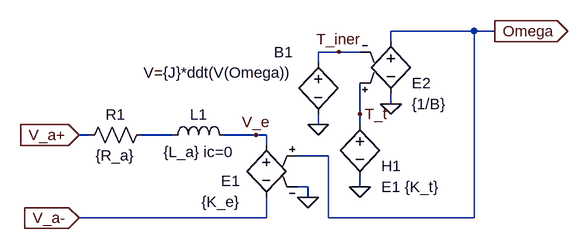
[diagram p0: schematic Standalone_LTspice_PMDC_motor.asc]
Standalone_LTspice_PMDC_motor.asc, the LTspice schematic file:
Version 4.1
SHEET 1 880 680
WIRE 336 32 208 32
WIRE 368 32 336 32
WIRE 208 48 208 32
WIRE 128 64 96 64
WIRE 160 64 128 64
WIRE 96 80 96 64
WIRE 208 144 208 128
WIRE 160 160 160 112
WIRE 96 176 96 160
WIRE 160 176 160 160
WIRE -256 192 -272 192
WIRE -128 192 -176 192
WIRE 0 192 -48 192
WIRE 16 192 0 192
WIRE 16 208 16 192
WIRE 112 224 64 224
WIRE 80 272 64 272
WIRE 160 272 160 256
WIRE 80 288 80 272
WIRE 16 320 16 288
WIRE 16 320 -272 320
WIRE 112 320 112 224
WIRE 336 320 336 32
WIRE 336 320 112 320
FLAG 96 176 0
FLAG 160 272 0
FLAG 368 32 Omega
IOPIN 368 32 Out
FLAG 80 288 0
FLAG 0 192 V_e
FLAG 160 160 T_t
FLAG 208 144 0
FLAG -272 192 V_a+
IOPIN -272 192 In
FLAG -272 320 V_a-
IOPIN -272 320 In
FLAG 128 64 T_iner
SYMBOL res -160 176 R90
WINDOW 0 0 56 VBottom 2
WINDOW 3 32 56 VTop 2
SYMATTR InstName R1
SYMATTR Value {R_a}
SYMBOL ind -144 208 R270
WINDOW 0 32 56 VTop 2
WINDOW 3 5 56 VBottom 2
SYMATTR InstName L1
SYMATTR Value {L_a} ic=0
SYMATTR SpiceLine Rser=0
SYMBOL e 16 192 M0
WINDOW 0 40 71 Left 2
WINDOW 3 40 103 Left 2
SYMATTR InstName E1
SYMATTR Value {K_e}
SYMBOL h 160 160 R0
WINDOW 0 33 80 Left 2
WINDOW 3 33 112 Left 2
SYMATTR InstName H1
SYMATTR Value E1 {K_t}
SYMBOL bv 96 64 M0
WINDOW 0 39 0 Left 2
WINDOW 3 39 32 Left 2
SYMATTR InstName B1
SYMATTR Value V={J}*ddt(V(Omega))
SYMBOL e2 208 32 R0
WINDOW 0 32 80 Left 2
WINDOW 3 32 112 Left 2
SYMATTR InstName E2
SYMATTR Value {1/B}

The netlist it stands for:
* Standalone_LTspice_PMDC_motor.asc
R1 N001 V_a+ {R_a}
L1 N001 V_e {L_a} ic=0 Rser=0
E1 V_e V_a- Omega 0 {K_e}
H1 T_t 0 E1 {K_t}
B1 T_iner 0 V={J}*ddt(V(Omega))
E2 Omega 0 T_t T_iner {1/B}
.backanno
.end